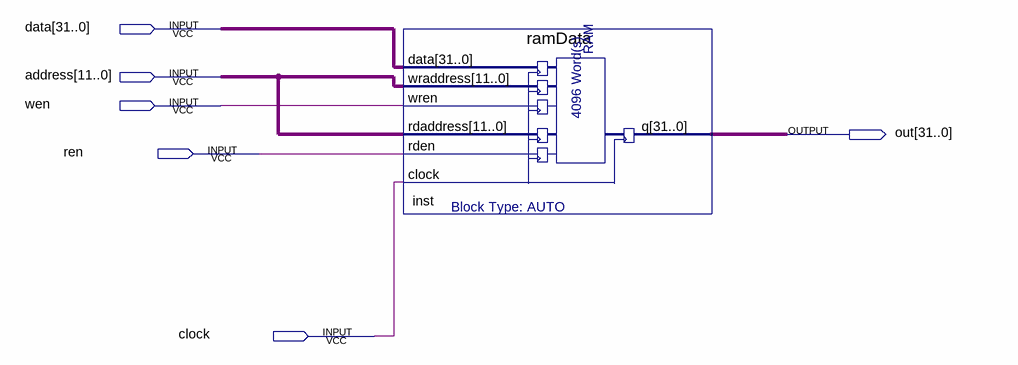
[diagram p0: schematic sheet]
// Quartus schematic memoria_data.bdf as structural Verilog: 1 symbols, 6 pins
module memoria_data (
  input  [31:0] data,
  input  [11:0] address,
  input  wen,
  input  ren,
  input  clock,
  output [31:0] out
);

  ramData inst (.data(data), .wraddress(address), .wren(wen), .rdaddress(address), .rden(ren), .clock(clock), .q(out));
endmodule
